# EAGLE schematic riffle-base (EAGLE 6.5.0)
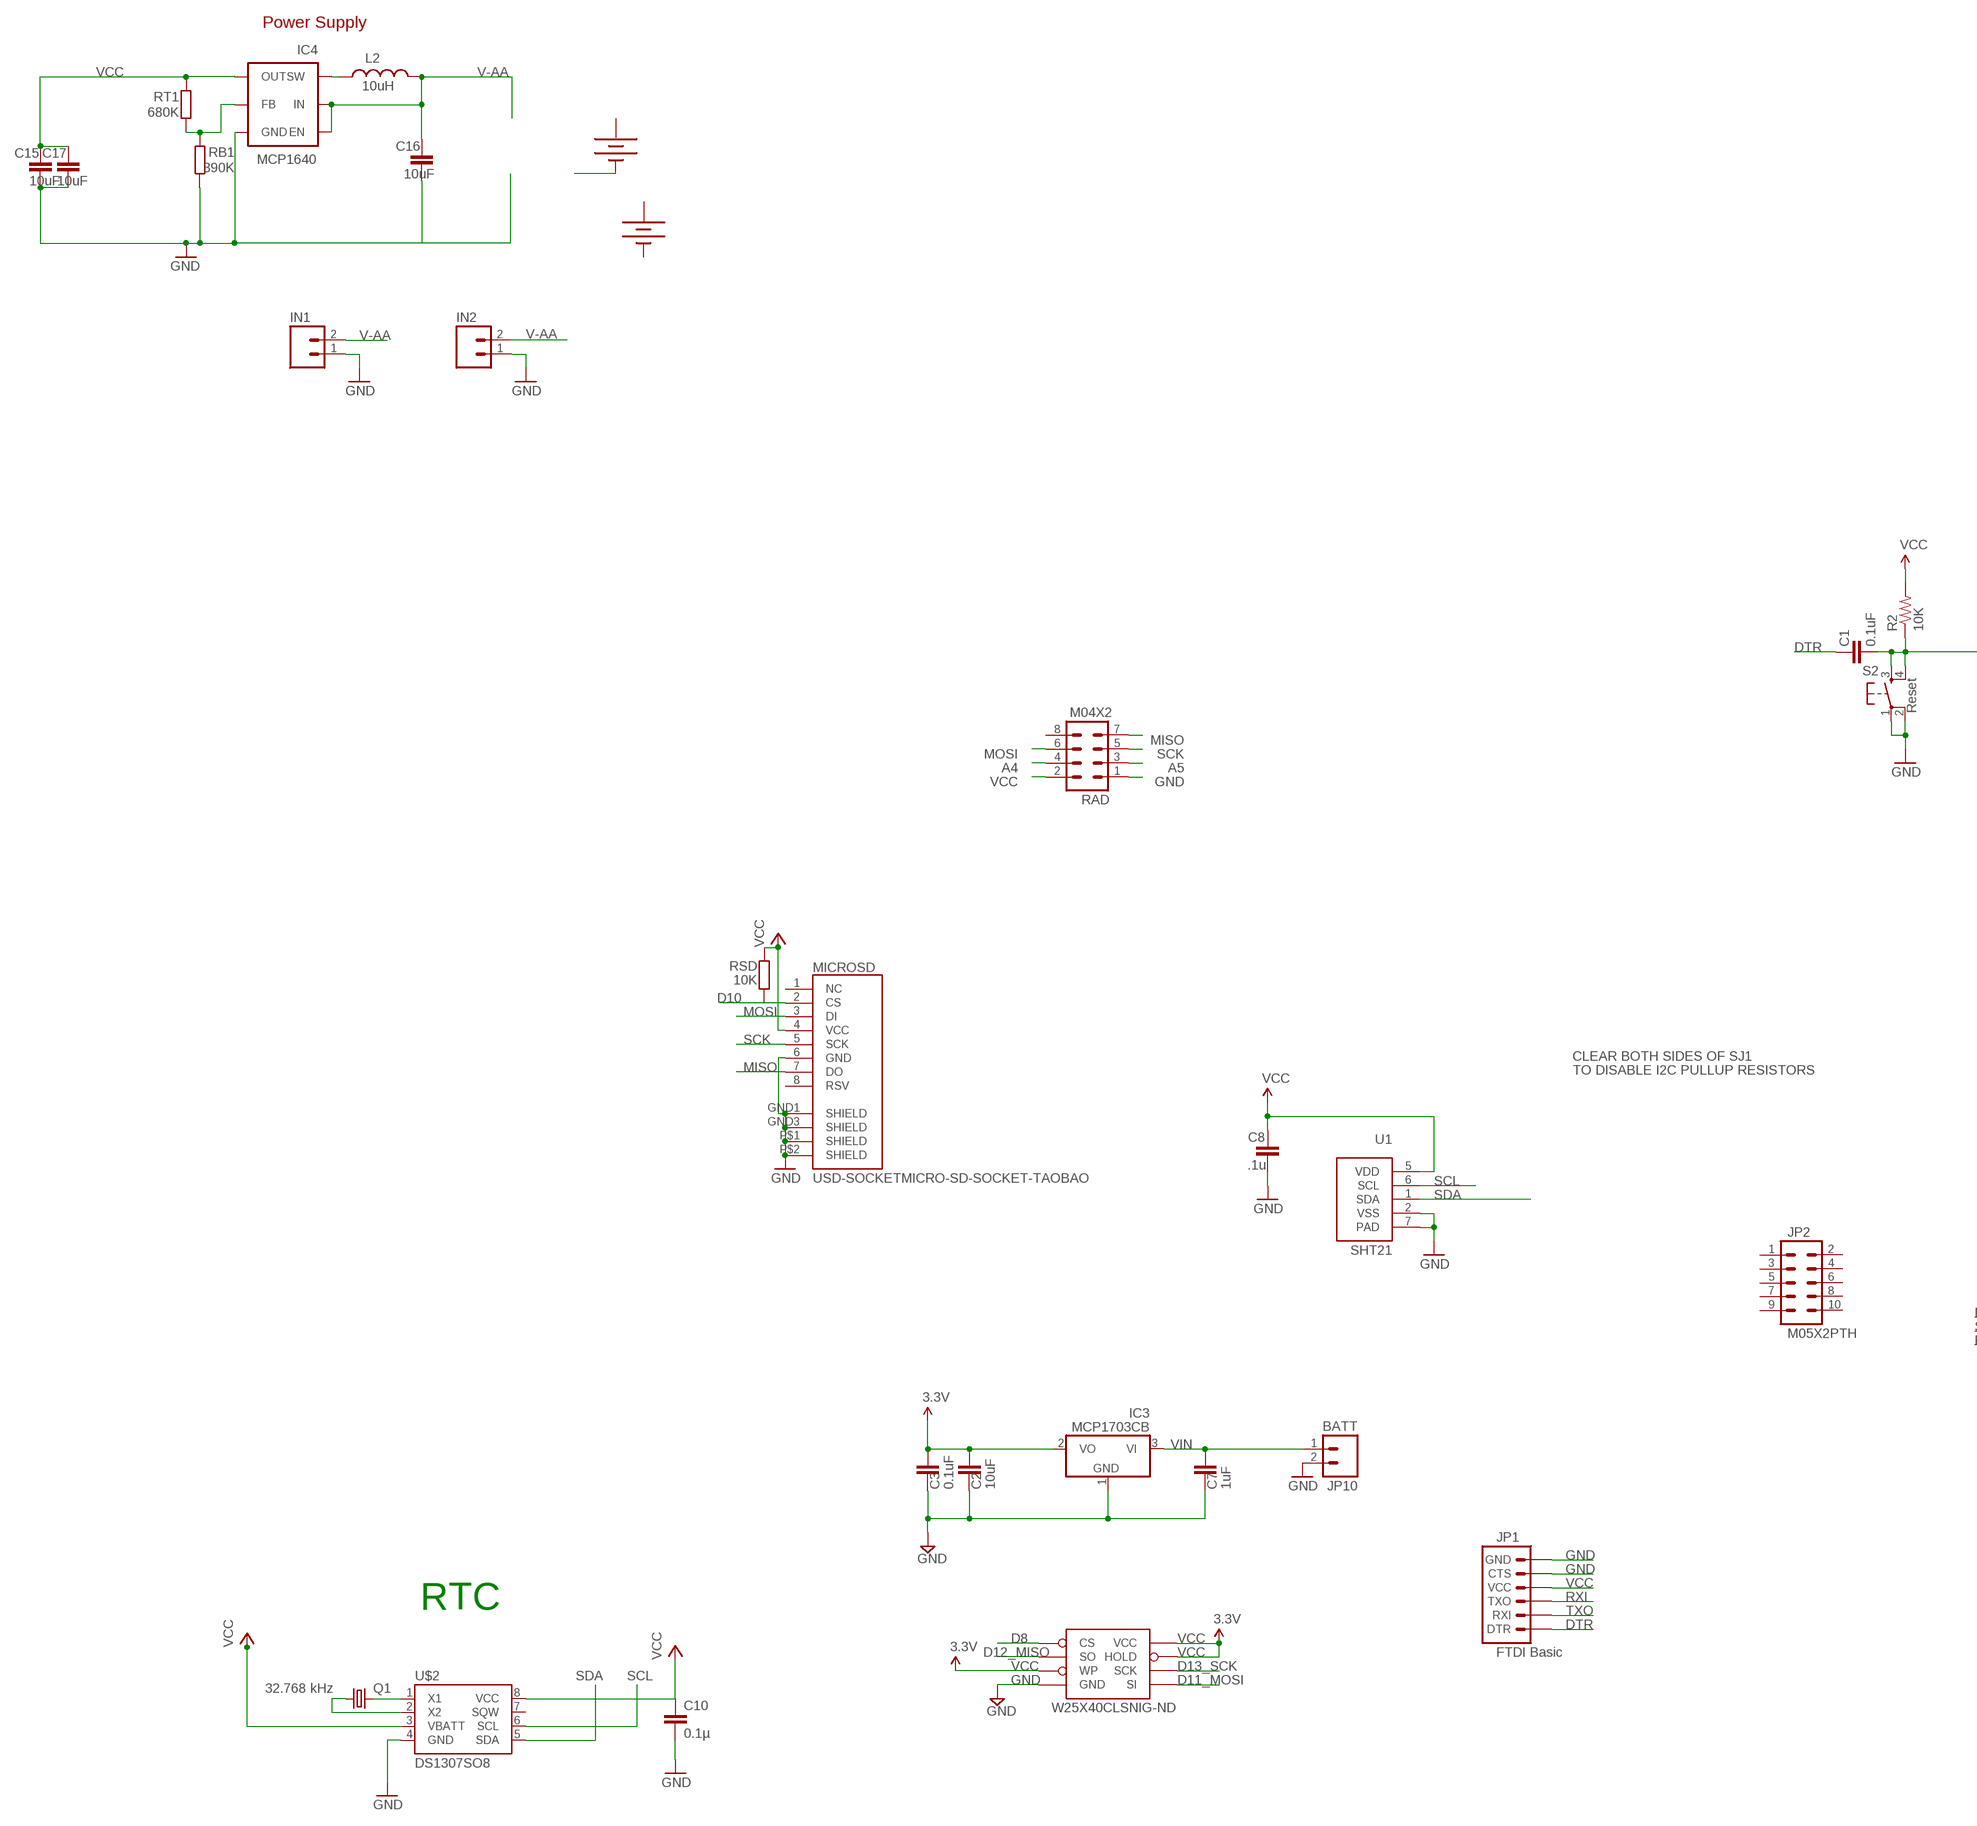
[diagram p0: schematic, sheet 1, part 1 of 2]
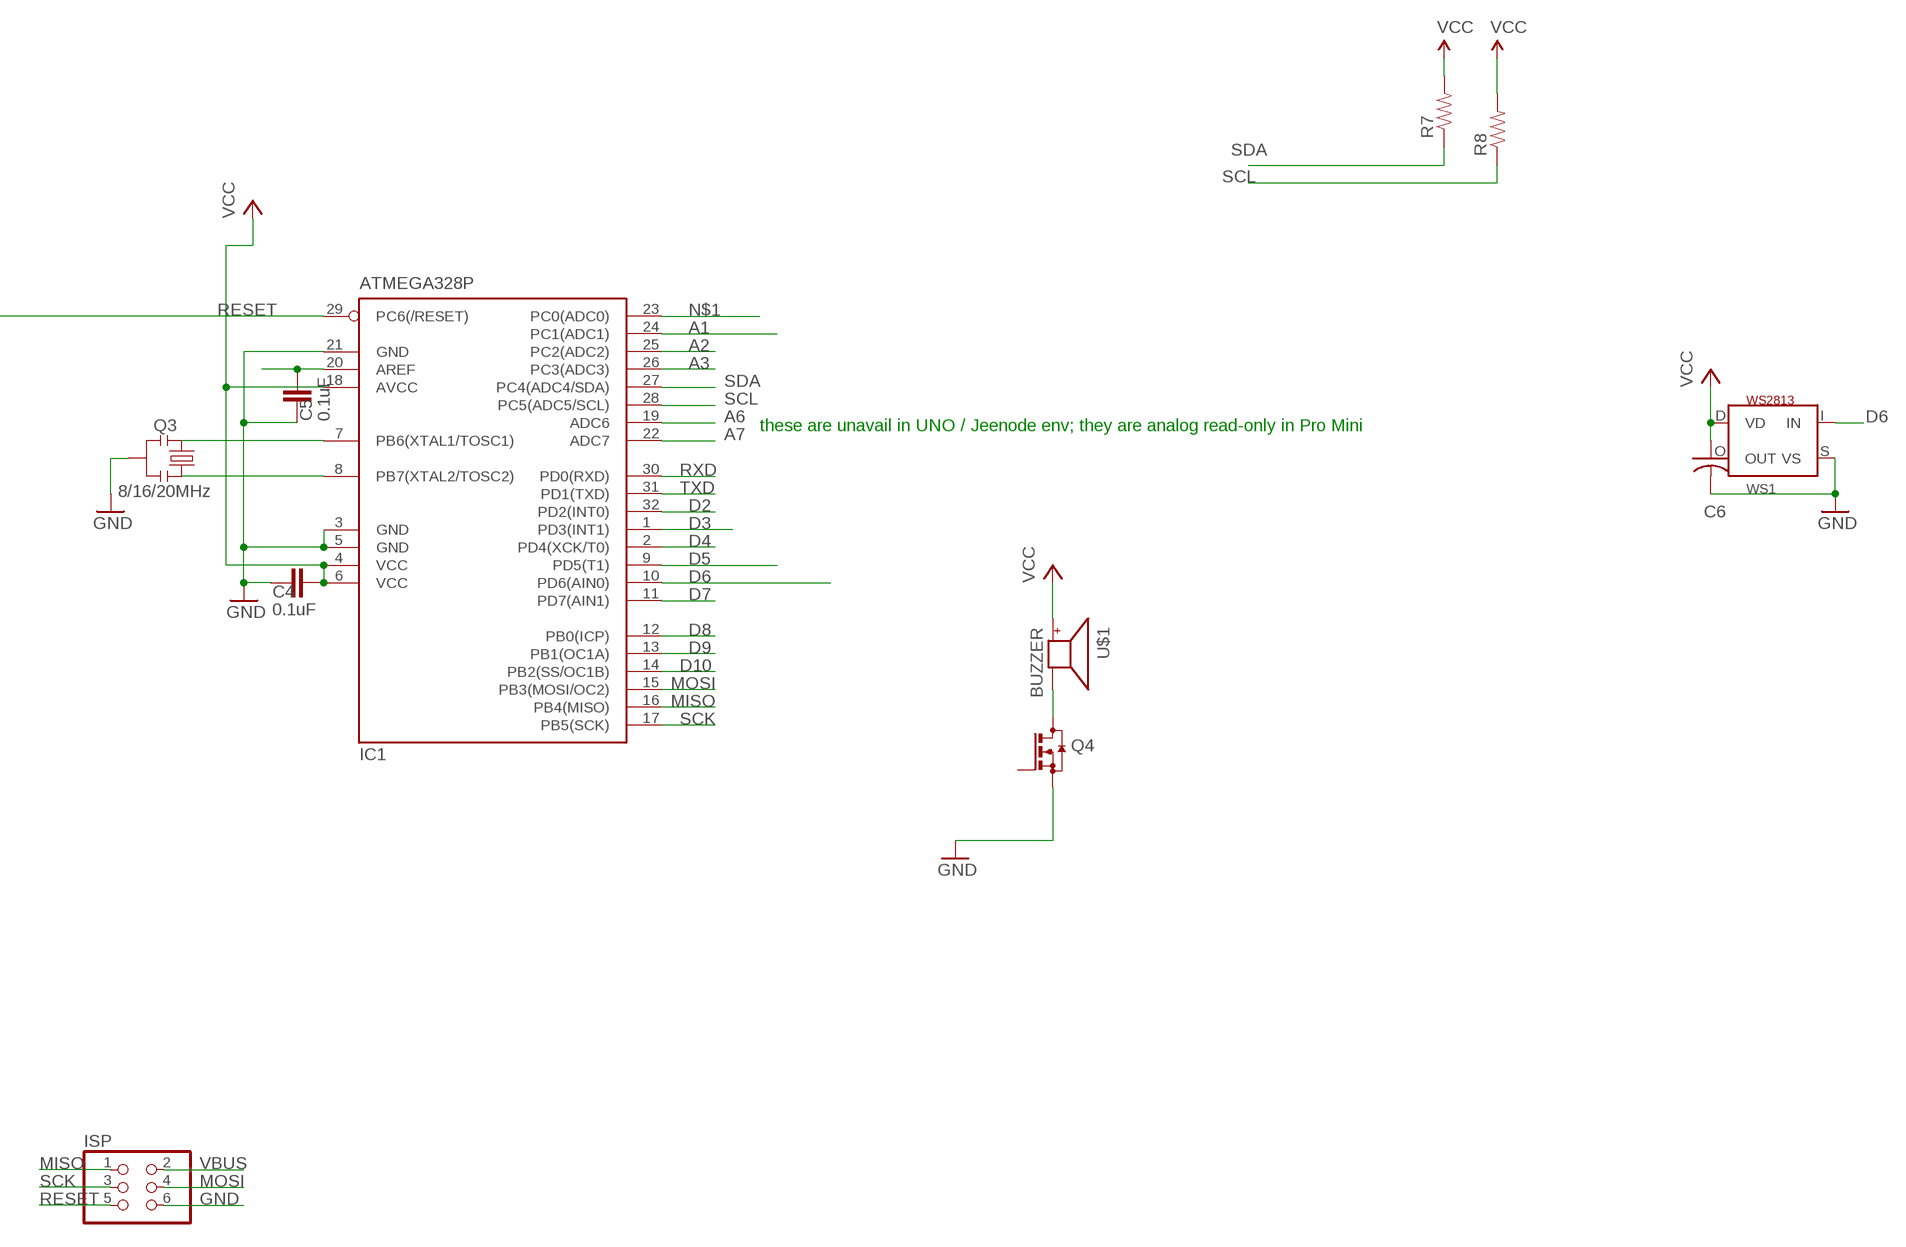
[diagram p1: schematic, sheet 1, part 2 of 2]

## Parts
AA1  BATTERYAA  [BATTERY-AA]
AA2  BATTERYAA  [BATTERY-AA]
C1  0.1uF  CAP0402-CAP  [0402-CAP]
C2  10uF  C-EUC0805  [C0805]
C3  0.1uF  C-EUC0805  [C0805]
C4  0.1uF  C-EUC0805  [C0805]
C5  0.1uF  C-EUC0805  [C0805]
C6  C-USC0805K  [C0805K]
C7  1uF  C-EUC0805  [C0805]
C8  .1u  C-EUC0805  [C0805]
C10  0.1µ  CAPPTH  [CAP-PTH-SMALL]
C15  10uF  C-EUC0805  [C0805]
C16  10uF  C-EUC0805  [C0805]
C17  10uF  C-EUC0805  [C0805]
IC1  ATMEGA328P  MEGA8-AI  [TQFP32-08]
IC3  MCP1703CB  [SOT23]
IC4  MCP1640  [TSOT23-6]
IN1  M02PTH  [1X02]
IN2  M02-JST-2MM-SMT  [JST-2-SMD]
ISP  PINHD-2X3  [2X03]
JP1  FTDI Basic  ARDUINO_SERIAL_PROGRAMPTH  [1X06]
JP2  M05X2PTH  [AVR_ICSP]
JP10  BATT  M02LOCK_LONGPADS  [1X02_LOCK_LONGPADS]
L2  10uH  INDUCTOR_SMDD30  [INDUCTOR_D30]
MICROSD  USD-SOCKETMICRO-SD-SOCKET-TAOBAO  [MICRO-SD-SOCKET-TAOBAO]
Q1  32.768 kHz  CRYSTALTC26H  [TC26H]
Q3  8/16/20MHz  RESONATORSMD  [RESONATOR-SMD]
Q4  BSS123  [SOT23]
R2  10K  RESISTOR0402-RES  [0402-RES]
R7  RESISTOR0402-RES  [0402-RES]
R8  RESISTOR0402-RES  [0402-RES]
RAD  M04X2  [2X4]
RB1  390K  R-EU_R0805  [R0805]
RSD  10K  R-EU_R0805  [R0805]
RT1  680K  R-EU_R0805  [R0805]
S2  Reset  TAC_SWITCHSMD  [TACTILE_SWITCH_SMD]
U1  SHT21  SEN-SENSIRION-SHT2X  [SEN-SENSIRION-SHT2X]
U$1  BUZZER  [SMT-8585-BUZZER]
U$2  DS1307SO8  [SO08]
W25X40CLSNIG-ND  AT25F512BWIDE_5.3MM  [SO08WIDE]
WS1  WS2813  [RGBLED5050_4]

## Nets
A1: IC1.24(PC1(ADC1))
A2: IC1.25(PC2(ADC2))
A3: IC1.26(PC3(ADC3))
A4: RAD.4
A5: RAD.3
A6: IC1.19(ADC6)
A7: IC1.22(ADC7)
AREF1: C5.2 IC1.20(AREF)
D2: IC1.32(PD2(INT0))
D3: IC1.1(PD3(INT1))
D4: IC1.2(PD4(XCK/T0))
D5: IC1.9(PD5(T1))
D6: IC1.10(PD6(AIN0)) WS1.I(IN)
D7: IC1.11(PD7(AIN1))
D8: IC1.12(PB0(ICP)) W25X40CLSNIG-ND.1(CS)
D9: IC1.13(PB1(OC1A))
D10: IC1.14(PB2(SS/OC1B)) MICROSD.2(CS) RSD.1
D11_MOSI: W25X40CLSNIG-ND.5(SI)
D12_MISO: W25X40CLSNIG-ND.2(SO)
D13_SCK: W25X40CLSNIG-ND.6(SCK)
DTR: C1.2 JP1.1(DTR)
GND [power]: C2.1 C3.1 C4.1 C5.1 C6.2 C7.1 C8.2 C10.2 C15.2 C16.2 C17.2 IC1.3(GND) IC1.5(GND) IC1.21(GND) IC3.1(GND) IC4.2(GND) IN1.1 IN2.1 ISP.6 JP1.5(CTS) JP1.6(GND) JP10.2 MICROSD.6(GND) MICROSD.GND1(SHIELD) MICROSD.GND3(SHIELD) MICROSD.P$1(SHIELD) MICROSD.P$2(SHIELD) Q3.2 Q4.2(S) RAD.1 RB1.1 S2.1 S2.2 U1.2(VSS) U1.7(PAD) U$2.4(GND) W25X40CLSNIG-ND.4(GND) WS1.S(VS)
GND1: AA2.GND@1(-)
MISO: IC1.16(PB4(MISO)) ISP.1 MICROSD.7(DO) RAD.7
MOSI: IC1.15(PB3(MOSI/OC2)) ISP.4 MICROSD.3(DI) RAD.6
N$1: IC1.23(PC0(ADC0))
N$3: IC1.7(PB6(XTAL1/TOSC1)) Q3.3
N$4: IC1.8(PB7(XTAL2/TOSC2)) Q3.1
N$7: Q4.3(D) U$1.-
N$15: Q1.2 U$2.1(X1)
N$16: Q1.1 U$2.2(X2)
N$20 [power]: IC4.1(SW) L2.P$2
N$21: IC4.4(FB) RB1.2 RT1.1
RESET: ISP.5
RESET1: C1.1 R2.1 S2.3 S2.4
RXD: IC1.30(PD0(RXD))
RXI: JP1.3(TXO)
SCK: IC1.17(PB5(SCK)) ISP.3 MICROSD.5(SCK) RAD.5
SCL: IC1.28(PC5(ADC5/SCL)) R8.1 U1.6(SCL) U$2.6(SCL)
SDA: IC1.27(PC4(ADC4/SDA)) R7.1 U1.1(SDA) U$2.5(SDA)
TXD: IC1.31(PD1(TXD))
TXO: JP1.2(RXI)
V-AA: C16.1 IC4.3(EN) IC4.6(IN) IN1.2 IN2.2 L2.P$1
VBUS: ISP.2
VCC: C2.2 C3.2 C4.2 C6.1 C8.1 C10.1 C15.1 C17.1 IC1.4(VCC) IC1.6(VCC) IC1.18(AVCC) IC3.2(VO) IC4.5(OUT) JP1.4(VCC) MICROSD.4(VCC) R2.2 R7.2 R8.2 RAD.2 RSD.2 RT1.2 U1.5(VDD) U$1.+ U$2.3(VBATT) U$2.8(VCC) W25X40CLSNIG-ND.3(WP) W25X40CLSNIG-ND.7(HOLD) W25X40CLSNIG-ND.8(VCC) WS1.D(VD) ; supply symbol labelled 3.3V
VIN [power]: C7.2 IC3.3(VI) JP10.1
Unconnected: IC1.29(PC6(/RESET)) JP2.1 JP2.2 JP2.3 JP2.4 JP2.5 JP2.6 JP2.7 JP2.8 JP2.9 JP2.10 MICROSD.1(NC) MICROSD.8(RSV) Q4.1(G) RAD.8 U$2.7(SQW) WS1.O(OUT)

## Notes on the sheet
- Power Supply
- these are unavail in UNO / Jeenode env; they are analog read-only in Pro Mini
- CLEAR BOTH SIDES OF SJ1
- TO DISABLE I2C PULLUP RESISTORS
- RTC

## Power pins joined to a net without a drawn wire
+: AA1.PWR@1(+) AA2.PWR@1(+)
-: AA1.GND@1(-)

## Library data of the parts
AA1 AA2 = SparkFun:BATTERY: Battery Holders Various common sizes : AA, AAA, 20mm coin cell and 12mm coin cell.
C1 C10 = SparkFun:CAP: Capacitor Standard 0603 ceramic capacitor, and 0.1" leaded capacitor.
C2-C5 C7 = rcl:C-EU: CAPACITOR, European symbol
C6 = adafruit2013:C-US: CAPACITOR, American symbol
C8 C15-C17 = resistor:C-EU: CAPACITOR, European symbol
IC1 = atmel:MEGA8: MICROCONTROLLER 8 Kbytes FLASH, 1 kbytes SRAM, 512 bytes EEPROM, USART, 6-channel 10 bit ADC, 2-channel 8 bit ADC Pin compatible with Atmega48, ATMega88, ATMega168 Source: avr.lbr; MPN: ATMEGA8-16AU; OC_FARNELL: 9171371; OC_NEWARK: 73M8863
IC3 = linear:MCP1703: 250 mA, 16V, Low Quiescent Current LDO Regulator Source: http://ww1.microchip.com/downloads/en/DeviceDoc/22049b.pdf
IC4 = linear-technology:MCP1640
IN1 IN2 JP10 = SparkFun:M02: Header 2 Standard 2-pin 0.1" header. Use with straight break away headers (SKU : PRT-00116), right angle break away headers (PRT-00553), swiss pins (PRT-00743), machine pins (PRT-00117), and female headers (PRT-00115). Molex polarized connector foot print use with SKU : PRT-08233 with associated crimp pins and housings.
ISP = pinhead:PINHD-2X3: PIN HEADER
JP1 = SparkFun:ARDUINO_SERIAL_PROGRAM
JP2 = SparkFun-Connectors:M05X2: Header 5x2 Standard 10-pin dual row 0.1" header. Commonly used with AVR-ISP. Use with Spark Fun Electronics SKU: PRT-00778
L2 = linear-technology:INDUCTOR_SMD
MICROSD = SparkFunNew:USD-SOCKET: microSD Socket Push-push type uSD socket. Schematic element and footprint production proven. Spark Fun Electronics SKU : PRT-00127. tDoc lines correctly indicate media card edge positions when inserting (unlocked, locked, depressed).
Q1 = SparkFun:CRYSTAL: Crystals Various standard crystals. Proven footprints. Spark Fun Electronics SKU : COM-00534
Q3 = SparkFun:RESONATOR: Resonator Small SMD resonator. This is the itty bitty 10/20MHz resonators with built in caps. CSTCE10M0G55 and CSTCE20M0V53. Footprint has been reviewed closely but hasn't been tested yet.
Q4 = transistor-small-signal:BSS123: N-CHANNEL MOS FET
R2 R7 R8 = SparkFun:RESISTOR: Resistor Basic schematic elements and footprints for 0603, 1206, and PTH resistors.
RAD = SparkFun-Connectors:M04X2: .1" header, two rows of four.
RB1 RSD RT1 = rcl:R-EU_: RESISTOR, European symbol
S2 = SparkFun:TAC_SWITCH: Momentary Switch Button commonly used for reset or general input. Spark Fun Electronics SKU : COM-00097
U1 = Misenso:SEN-SENSIRION-SHT2X
U$1 = adafruit:BUZZER
U$2 = SparkFun:DS1307
W25X40CLSNIG-ND = LowPowerLab:AT25F512B: 4-Mbit SPI flash memory
WS1 = adafruit:WS2813

## Net classes
0 default: width 0.406 mm, clearance 0.203 mm
1 power: width 0.381 mm, clearance 0.254 mm